# Altium schematic sheet Outpin.schdoc
size 51 x 35 mm
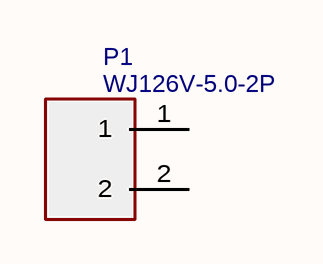
[diagram p0: Outpin.schdoc]

## Parts
P1  WJ126V-5.0-2P  [CONN-TH_WJ126V-5.0-2P]

## Nets

Not connected (* = marked no-connect by the designer): P1 1 2

## Library data of the parts
P1 = WJ126V-5.0-2P: BOM_Manufacturer: ReliaPro; BOM_Supplier: LCSC; BOM_Manufacturer Part: WJ126V-5.0-2P; BOM_Supplier Part: C8404; BOM_JLCPCB Part Class: Extended Part; spicePre: P; spiceSymbolName: WJ126V-5.0-2P